# EAGLE design CeeGrid Anschluss (EAGLE 9.6.0)
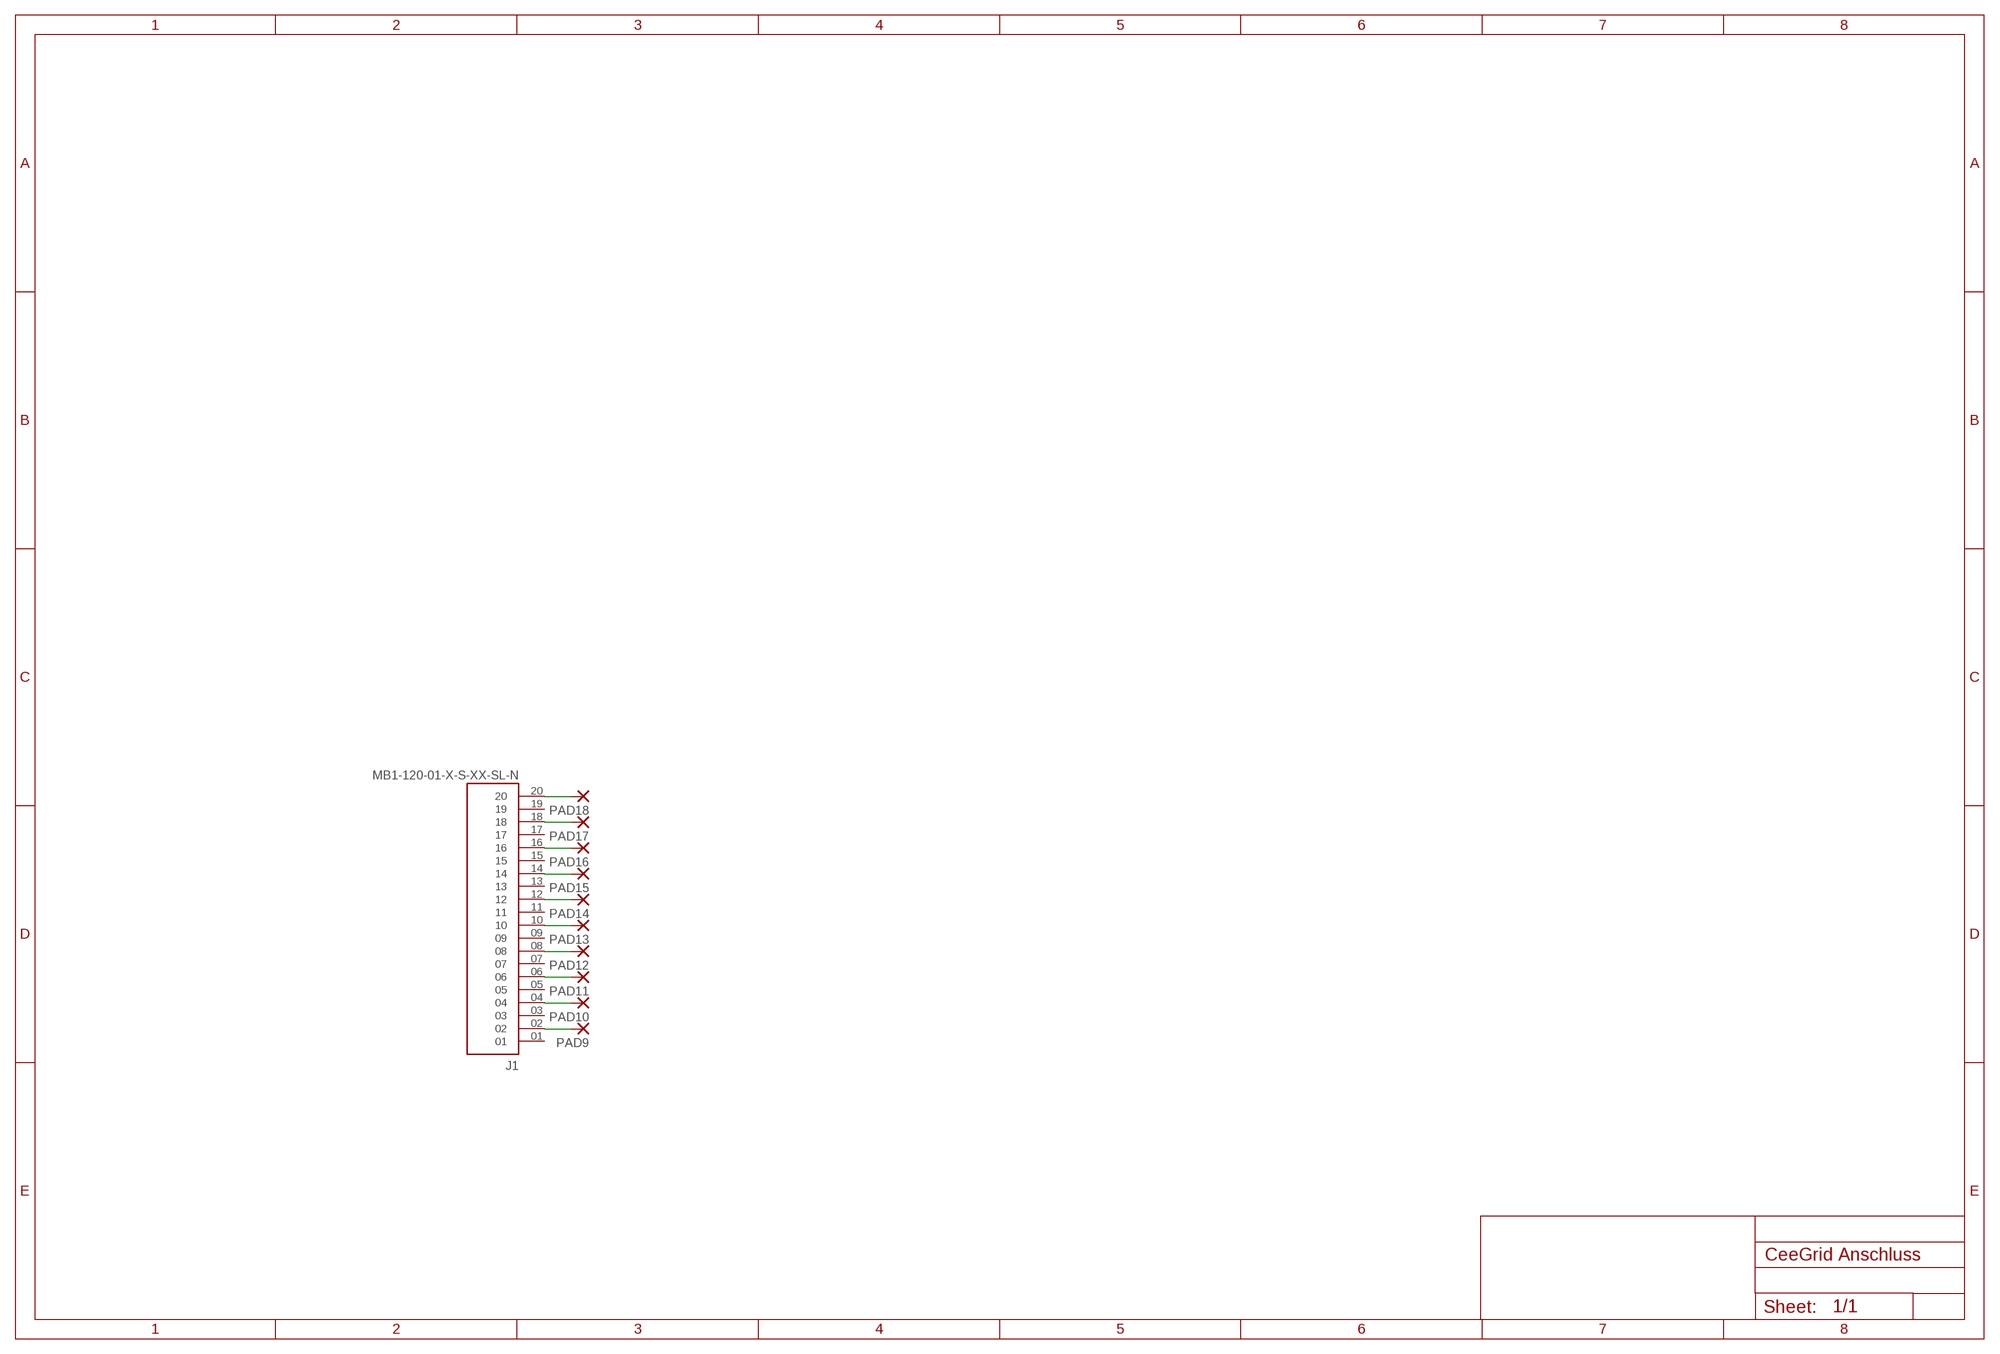
[diagram p0: schematic, sheet 1]

## Parts
J1  MB1-120-01-X-S-XX-SL-N  [SAMTEC_MB1-120-01-X-S-XX-SL-N]
PAD9  SMD2  [SMD1,27-2,54]
PAD10  SMD2  [SMD1,27-2,54]
PAD11  SMD2  [SMD1,27-2,54]
PAD12  SMD2  [SMD1,27-2,54]
PAD13  SMD2  [SMD1,27-2,54]
PAD14  SMD2  [SMD1,27-2,54]
PAD15  SMD2  [SMD1,27-2,54]
PAD16  SMD2  [SMD1,27-2,54]
PAD17  SMD2  [SMD1,27-2,54]
PAD18  SMD2  [SMD1,27-2,54]

## Nets
N$9: J1.20 PAD18.1(P)
N$10: J1.18 PAD17.1(P)
N$11: J1.16 PAD16.1(P)
N$12: J1.14 PAD15.1(P)
N$13: J1.12 PAD14.1(P)
N$14: J1.10 PAD13.1(P)
N$15: J1.08 PAD12.1(P)
N$16: J1.06 PAD11.1(P)
N$17: J1.04 PAD10.1(P)
N$18: J1.02 PAD9.1(P)
Unconnected: J1.01 J1.03 J1.05 J1.07 J1.09 J1.11 J1.13 J1.15 J1.17 J1.19

## Library data of the parts
J1 = MB1-120-01-X-S-XX-SL-N:MB1-120-01-X-S-XX-SL-N: 1mm Mini-Card Guide; MANUFACTURER: Samtec; MAXIMUM_PACKAGE_HEIGHT: 5.44 mm; PARTREV: J; STANDARD: Manufacturer Recommendations
PAD9-PAD18 = wirepad:SMD2: SMD PAD

## Board
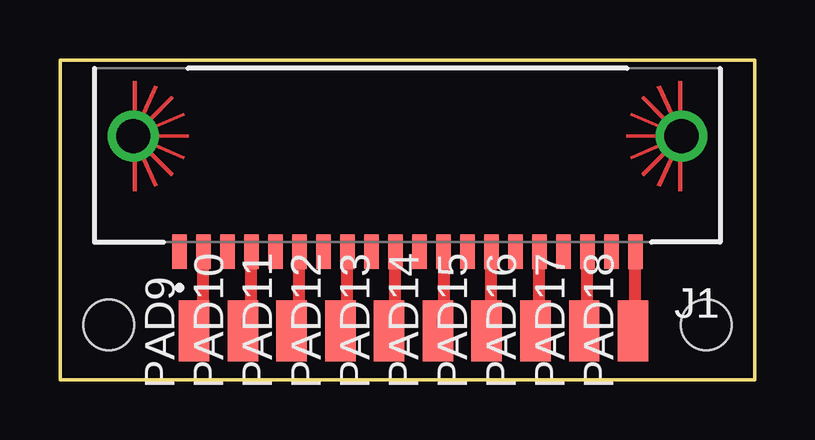
[diagram p1: board, top side]

Size 28.96 x 13.34 mm. Coordinates in mm from the lower left corner, seen from the top.
Outline: 0,13.34 28.96,13.34 28.96,0 0,0 0,13.34
Copper layers (1*16): Top 0.035mm / dielectric 1.5mm / Bottom 0.035mm
Design rules "default": minimum track width 6mil, minimum drill 0.35mm, track to track 6mil, track to pad 6mil, pad to pad 6mil, via to via 6mil, smd to smd 6mil, copper to edge 40mil, drill to drill 6mil, minimum pad ring 10mil, minimum via ring 8mil, stop-mask expansion 4mil, vias tented up to drill 0mil, thermal gap 10mil
Holes 2.1 mm at 2.03,2.29 26.92,2.29

### Footprints (pad centres in the part's own frame; a part is rotated, then mirrored left to right if it is on the bottom)
SAMTEC_MB1-120-01-X-S-XX-SL-N = smd 0.61 x 1.45: 01 9.5,0; 02 8.5,0; 03 7.5,0; 04 6.5,0; 05 5.5,0; 06 4.5,0; 07 3.5,0; 08 2.5,0; 09 1.5,0; 10 0.5,0; 11 -0.5,0; 12 -1.5,0; 13 -2.5,0; 14 -3.5,0; 15 -4.5,0; 16 -5.5,0; 17 -6.5,0; 18 -7.5,0; 19 -8.5,0; 20 -9.5,0 | drill 1.422 pad 1.702: S1 -11.42,-4.826; S2 11.42,-4.826
SMD1,27-2,54 = smd 1.27 x 2.54: 1 0,0

### Placement (x,y rotation side)
J1  14.48,5.33 180 top
PAD9  5.59,2.03 0 top
PAD10  7.62,2.03 0 top
PAD11  9.65,2.03 0 top
PAD12  11.68,2.03 0 top
PAD13  13.72,2.03 0 top
PAD14  15.75,2.03 0 top
PAD15  17.78,2.03 0 top
PAD16  19.81,2.03 0 top
PAD17  21.84,2.03 0 top
PAD18  23.88,2.03 0 top

### Tracks (layer width: path | path; a pad name or v marks a point on that pad's centre or on a via)
N$9
  Top 0.508: PAD18.1 23.98,2.13 J1.20
N$10
  Top 0.508: PAD17.1 21.98,2.17 J1.18
N$11
  Top 0.508: PAD16.1 19.98,2.2 J1.16
N$12
  Top 0.508: 18.03,5.28 J1.14 17.98,2.23 PAD15.1 18.03,2.29
N$13
  Top 0.508: J1.12 16,5.31 16,2.29 PAD14.1
N$14
  Top 0.508: PAD13.1 13.98,2.29 J1.10
N$15
  Top 0.508: PAD12.1 11.98,2.33 J1.08
N$16
  Top 0.508: PAD11.1 9.98,2.36 J1.06
N$17
  Top 0.508: PAD10.1 7.98,2.39 J1.04
N$18
  Top 0.508: PAD9.1 5.98,2.42 J1.02